# EAGLE design ACL_Rehab_Tracker (EAGLE 9.6.2)
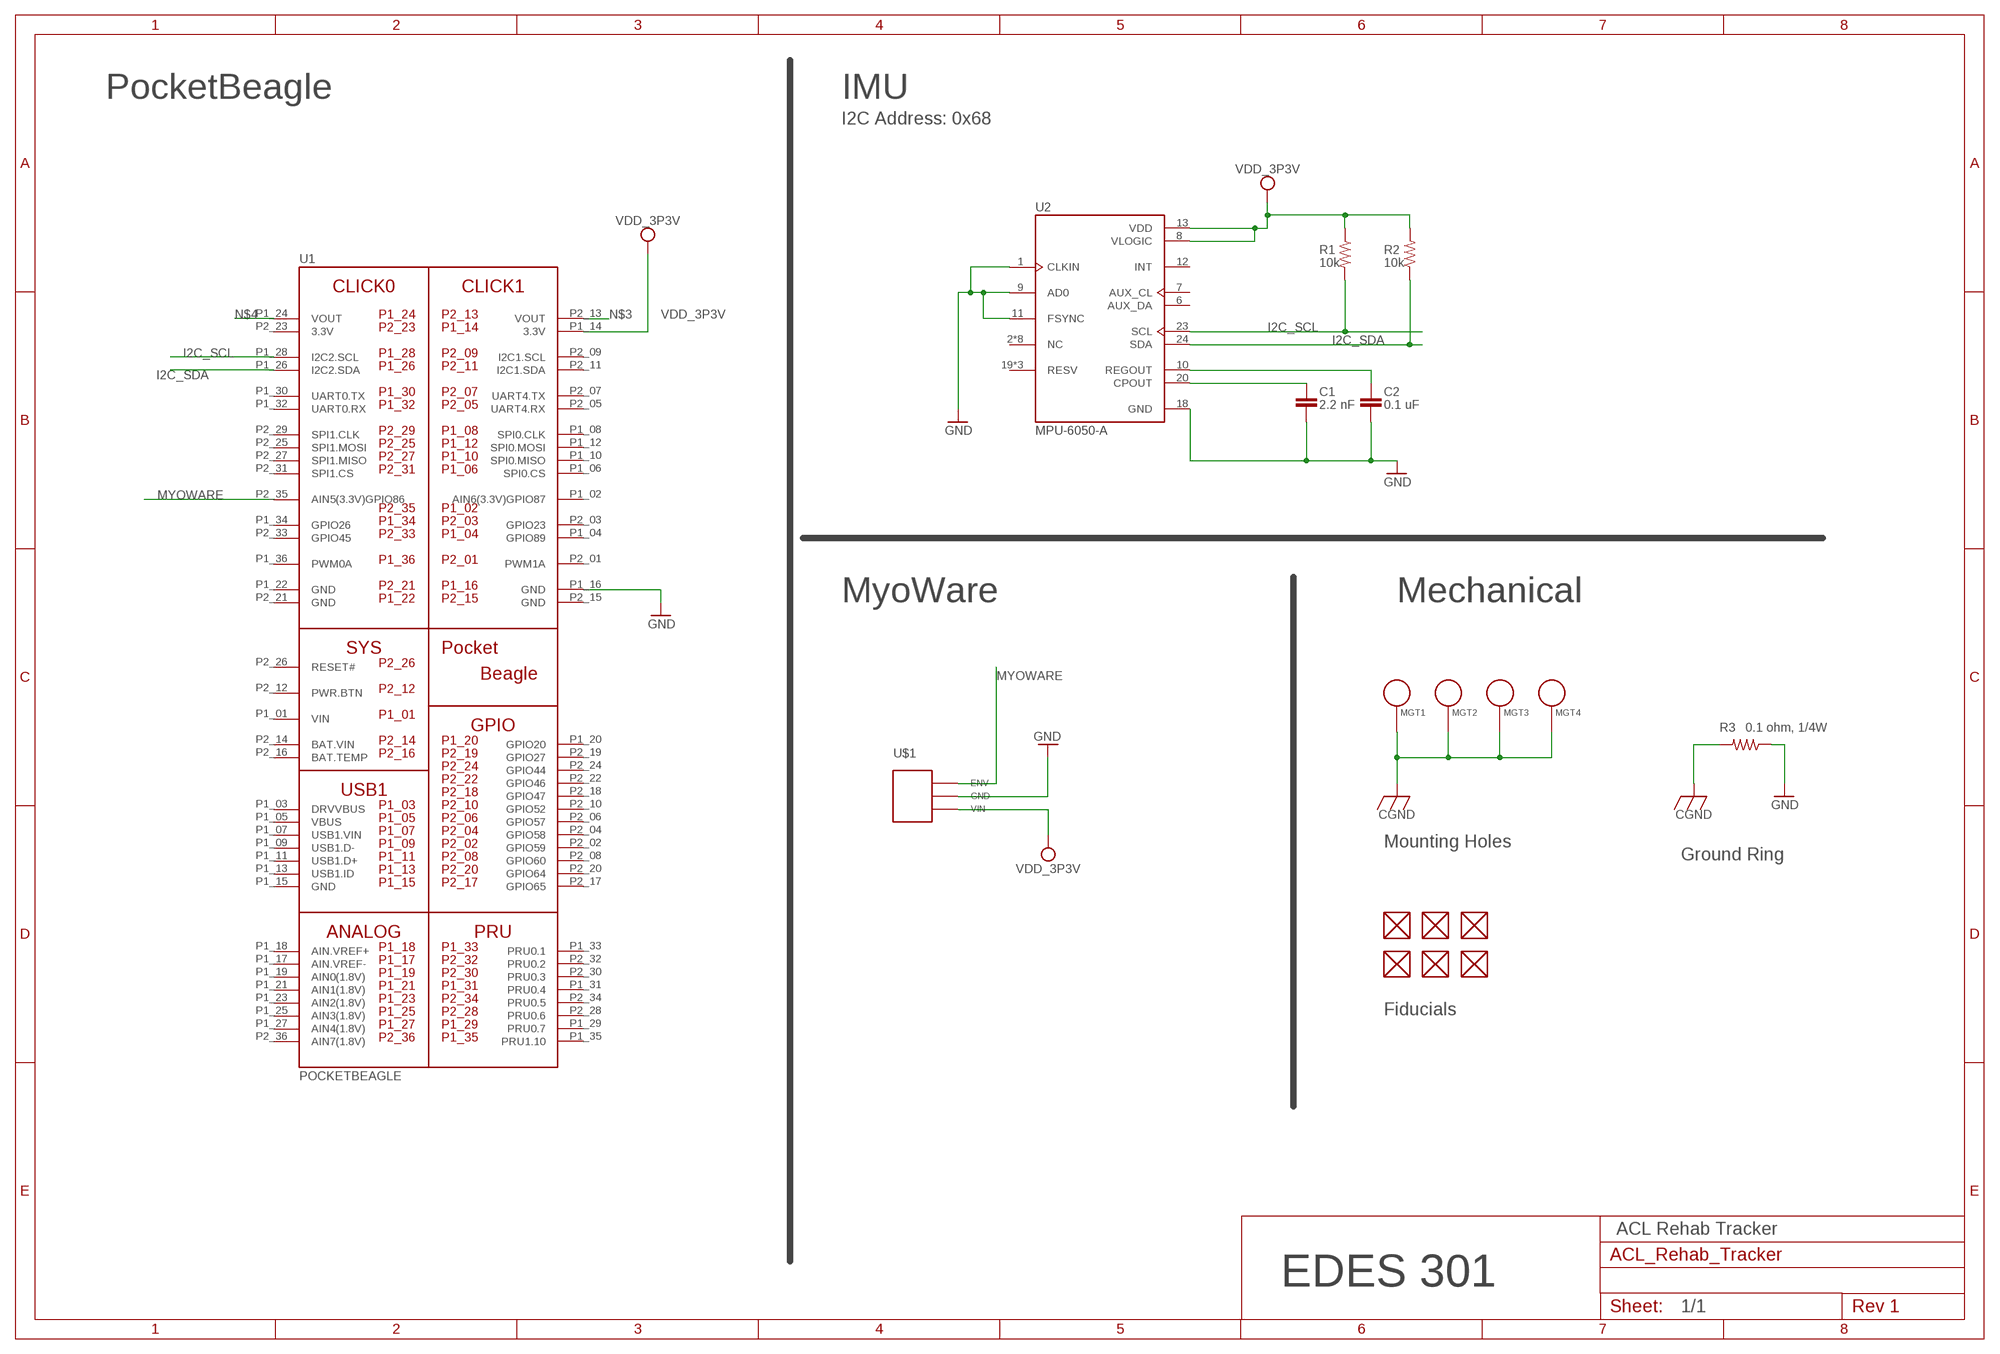
[diagram p0: schematic, sheet 1]

## Parts
C1  2.2 nF  C_C0603  [C0603]
C2  0.1 uF  C_C0603  [C0603]
FUD1  FIDUCIAL  [FIDUCIAL_40MIL]
FUD2  FIDUCIAL  [FIDUCIAL_40MIL]
FUD3  FIDUCIAL  [FIDUCIAL_40MIL]
FUD4  FIDUCIAL  [FIDUCIAL_40MIL]
FUD5  FIDUCIAL  [FIDUCIAL_40MIL]
FUD6  FIDUCIAL  [FIDUCIAL_40MIL]
MGT1  MOUNTING_HOLE  [MOUNTING_HOLE]
MGT2  MOUNTING_HOLE  [MOUNTING_HOLE]
MGT3  MOUNTING_HOLE  [MOUNTING_HOLE]
MGT4  MOUNTING_HOLE  [MOUNTING_HOLE]
R1  10k  R_R0603  [R0603]
R2  10k  R_R0603  [R0603]
R3  0.1 ohm, 1/4W  R_R0603  [R0603]
U1  POCKETBEAGLE  [POCKETBEAGLE]
U2  MPU-6050-A  [QFN50P400X400X95-24N]
U$1  MYOWARE-2.0-MUSCLE  [MYOWARE-3PIN-THR]

## Nets
CGND: MGT1.P$1 MGT2.P$1 MGT3.P$1 MGT4.P$1 R3.2
GND: C1.2 C2.2 R3.1 U1.P1_16(GND) U2.1(CLKIN) U2.9(AD0) U2.11(FSYNC) U2.18(GND) U$1.2
I2C_SCL: R1.2 U1.P1_28(I2C2.SCL) U2.23(SCL)
I2C_SDA: R2.1 U1.P1_26(I2C2.SDA) U2.24(SDA)
MYOWARE: U1.P2_35(AIN5(3.3V)GPIO86) U$1.1
N$1: C1.1 U2.20(CPOUT)
N$2: C2.1 U2.10(REGOUT)
N$3: U1.P2_13(VOUT)
N$4: U1.P1_24(VOUT)
VDD_3P3V: R1.1 R2.2 U1.P1_14(3.3V) U2.8(VLOGIC) U2.13(VDD) U$1.3
Unconnected: FUD1.P$1 FUD2.P$1 FUD3.P$1 FUD4.P$1 FUD5.P$1 FUD6.P$1 U1.P1_02(AIN6(3.3V)GPIO87) U1.P1_03(DRVVBUS) U1.P1_04(GPIO89) U1.P1_05(VBUS) U1.P1_06(SPI0.CS) U1.P1_07(USB1.VIN) U1.P1_08(SPI0.CLK) U1.P1_09(USB1.D-) U1.P1_10(SPI0.MISO) U1.P1_11(USB1.D+) U1.P1_12(SPI0.MOSI) U1.P1_13(USB1.ID) U1.P1_15(GND) U1.P1_17(AIN.VREF-) U1.P1_18(AIN.VREF+) U1.P1_19(AIN0(1.8V)) U1.P1_20(GPIO20) U1.P1_21(AIN1(1.8V)) U1.P1_23(AIN2(1.8V)) U1.P1_25(AIN3(1.8V)) U1.P1_27(AIN4(1.8V)) U1.P1_29(PRU0.7) U1.P1_30(UART0.TX) U1.P1_31(PRU0.4) U1.P1_32(UART0.RX) U1.P1_33(PRU0.1) U1.P1_34(GPIO26) U1.P1_35(PRU1.10) U1.P1_36(PWM0A) U1.P2_01(PWM1A) U1.P2_02(GPIO59) U1.P2_03(GPIO23) U1.P2_04(GPIO58) U1.P2_05(UART4.RX) U1.P2_06(GPIO57) U1.P2_07(UART4.TX) U1.P2_08(GPIO60) U1.P2_09(I2C1.SCL) U1.P2_10(GPIO52) U1.P2_11(I2C1.SDA) U1.P2_12(PWR.BTN) U1.P2_16(BAT.TEMP) U1.P2_17(GPIO65) U1.P2_18(GPIO47) U1.P2_19(GPIO27) U1.P2_20(GPIO64) U1.P2_22(GPIO46) U1.P2_24(GPIO44) U1.P2_25(SPI1.MOSI) U1.P2_26(RESET#) U1.P2_27(SPI1.MISO) U1.P2_28(PRU0.6) U1.P2_29(SPI1.CLK) U1.P2_30(PRU0.3) U1.P2_31(SPI1.CS) U1.P2_32(PRU0.2) U1.P2_33(GPIO45) U1.P2_34(PRU0.5) U1.P2_36(AIN7(1.8V)) U2.2(NC) U2.3(NC) U2.4(NC) U2.5(NC) U2.6(AUX_DA) U2.7(AUX_CL) U2.12(INT) U2.14(NC) U2.15(NC) U2.16(NC) U2.17(NC) U2.19(RESV) U2.21(RESV) U2.22(RESV)

## Notes on the sheet
- PocketBeagle | IMU
- I2C Address: 0x68
- MyoWare | Mechanical
- Mounting Holes
- Ground Ring
- Fiducials
- ACL Rehab Tracker
- EDES 301
- 1/1

## Power pins joined to a net without a drawn wire
3.3V: U1.P2_23(3.3V)
BAT.VIN: U1.P2_14(BAT.VIN)
GND: U1.P1_22(GND) U1.P2_15(GND) U1.P2_21(GND)
VIN: U1.P1_01(VIN)

## Library data of the parts
C1 C2 = Project_02_EDES_301:C_: Capacitor SMD. Sizes: 0402, 0603 & 0805
FUD1-FUD6 = Project_02_EDES_301:FIDUCIAL
MGT1-MGT4 = Project_02_EDES_301:MOUNTING_HOLE: Chassis Mounting Hole w/GND connection ability
R1-R3 = Project_02_EDES_301:R_: RESISTOR, American symbol
U1 = Project_02_EDES_301:POCKETBEAGLE
U2 = Project_02_EDES_301:MPU-6050-A: Check availability <https://pricing.snapeda.com/parts/MPU-6050-A/TDK%20InvenSense/view-part?ref=eda>; AVAILABILITY: In Stock; CHECK_PRICES: https://www.snapeda.com/parts/MPU-6050-A/TDK/view-part/?ref=eda; DESCRIPTION: MOTION TRACKING DEVICE; MF: TDK InvenSense; MP: MPU-6050-A; PACKAGE: QFN-24 InvenSense; PRICE: None; SNAPEDA_LINK: https://www.snapeda.com/parts/MPU-6050-A/TDK/view-part/?ref=snap
U$1 = Project_02_EDES_301:MYOWARE-2.0-MUSCLE

## Board
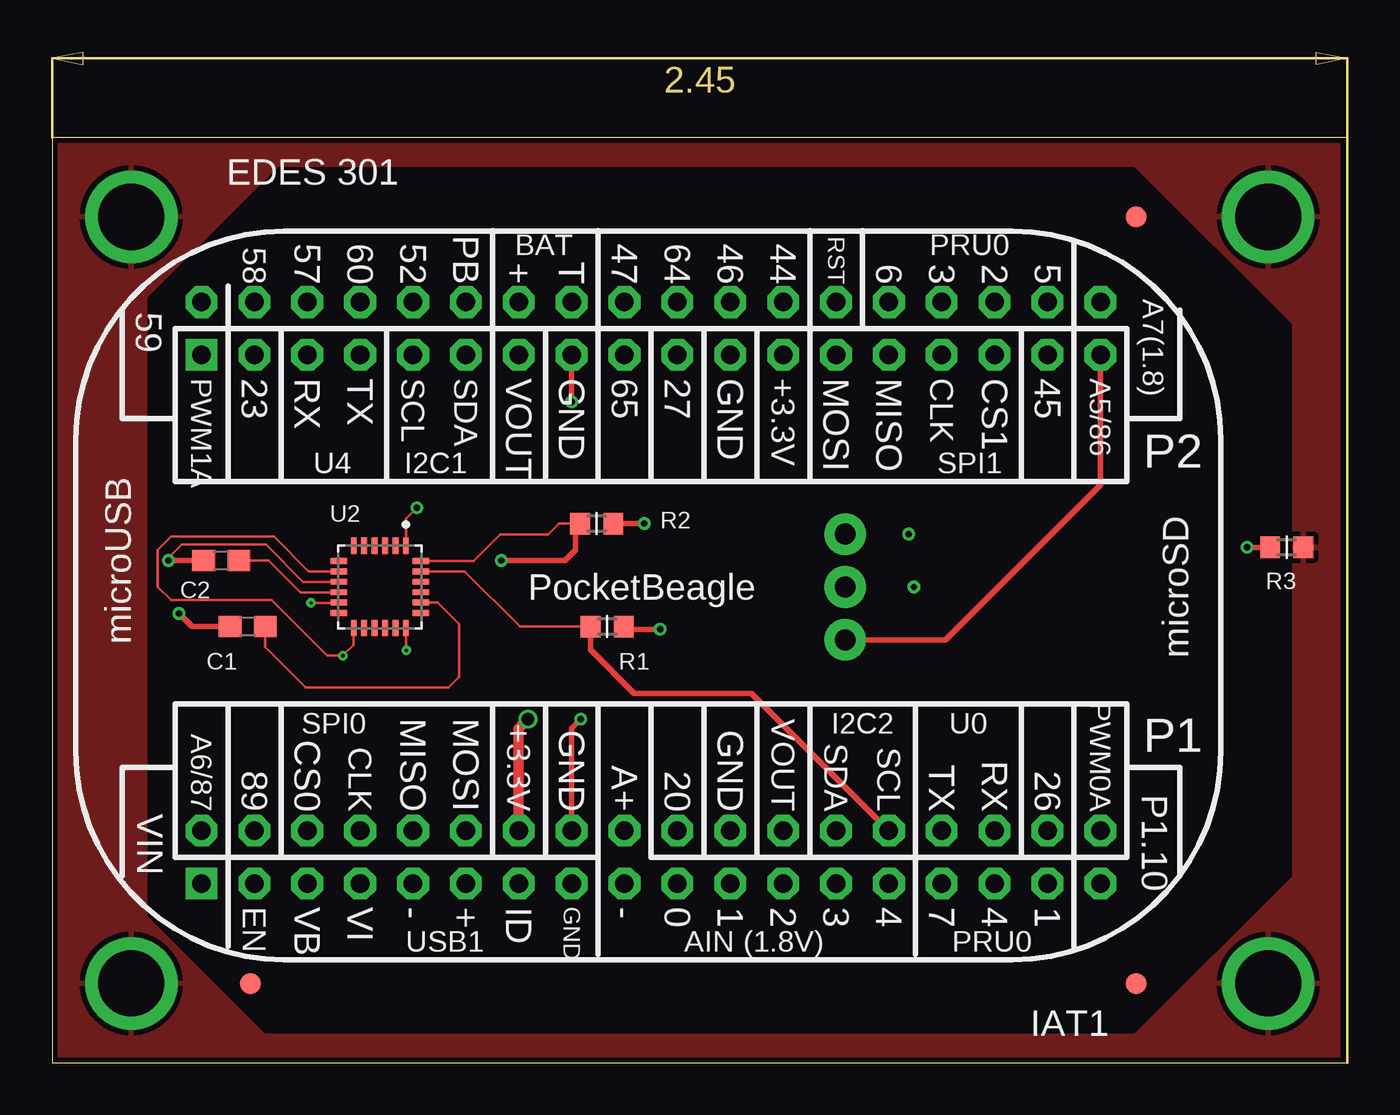
[diagram p1: board, top side]
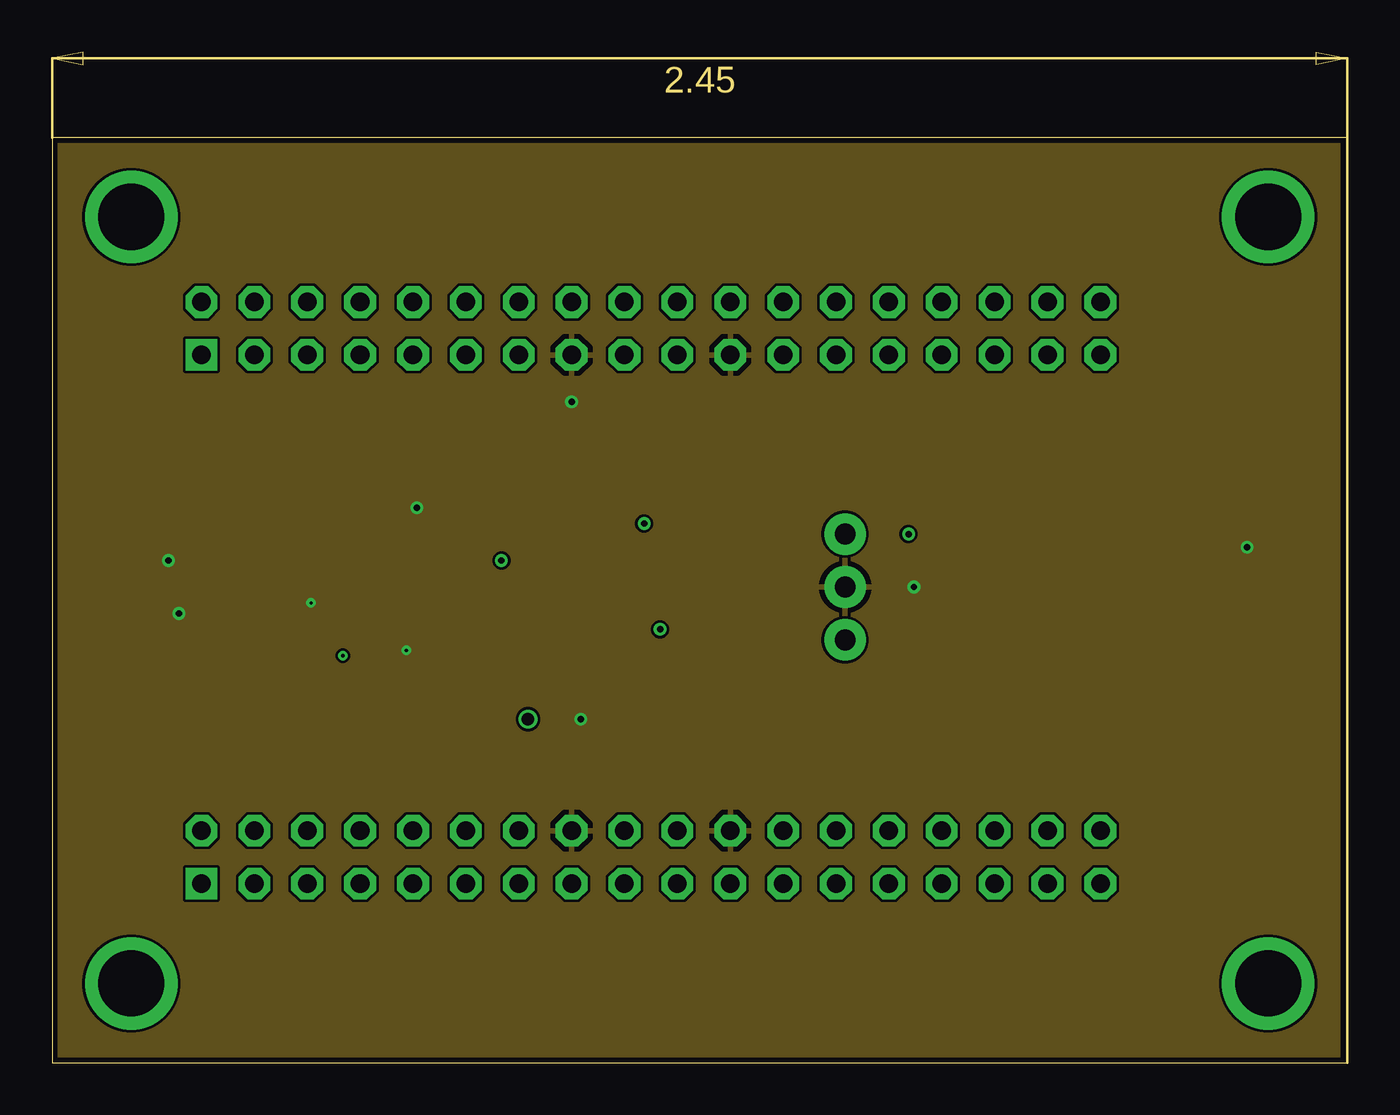
[diagram p2: board, inner layer Route2]
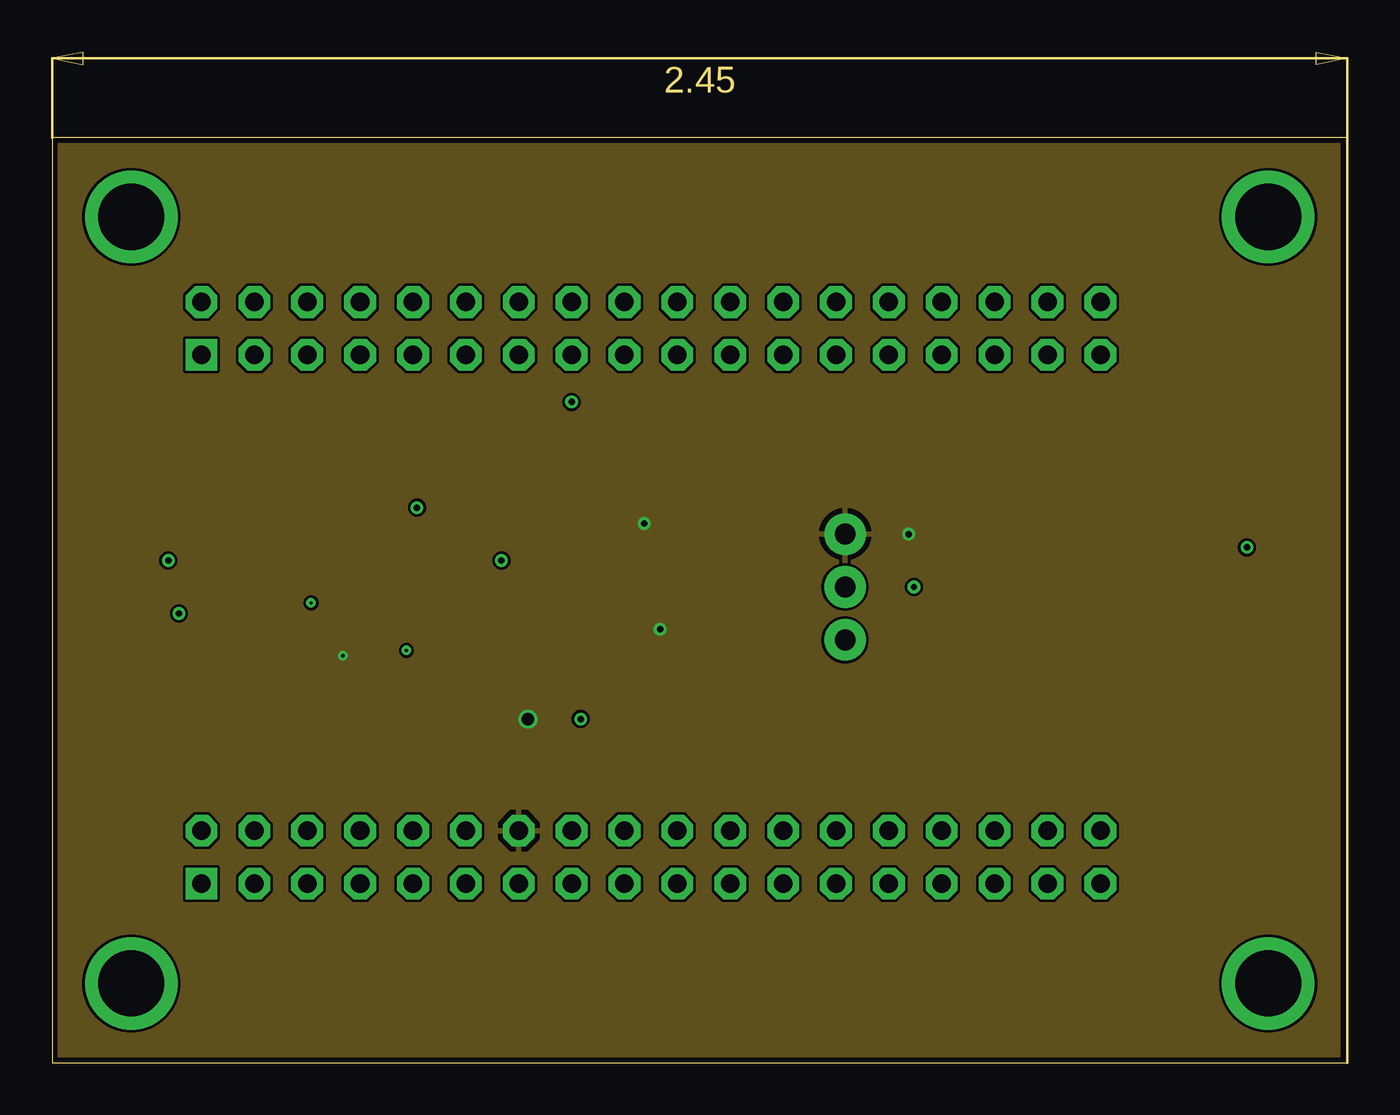
[diagram p3: board, inner layer Route15]
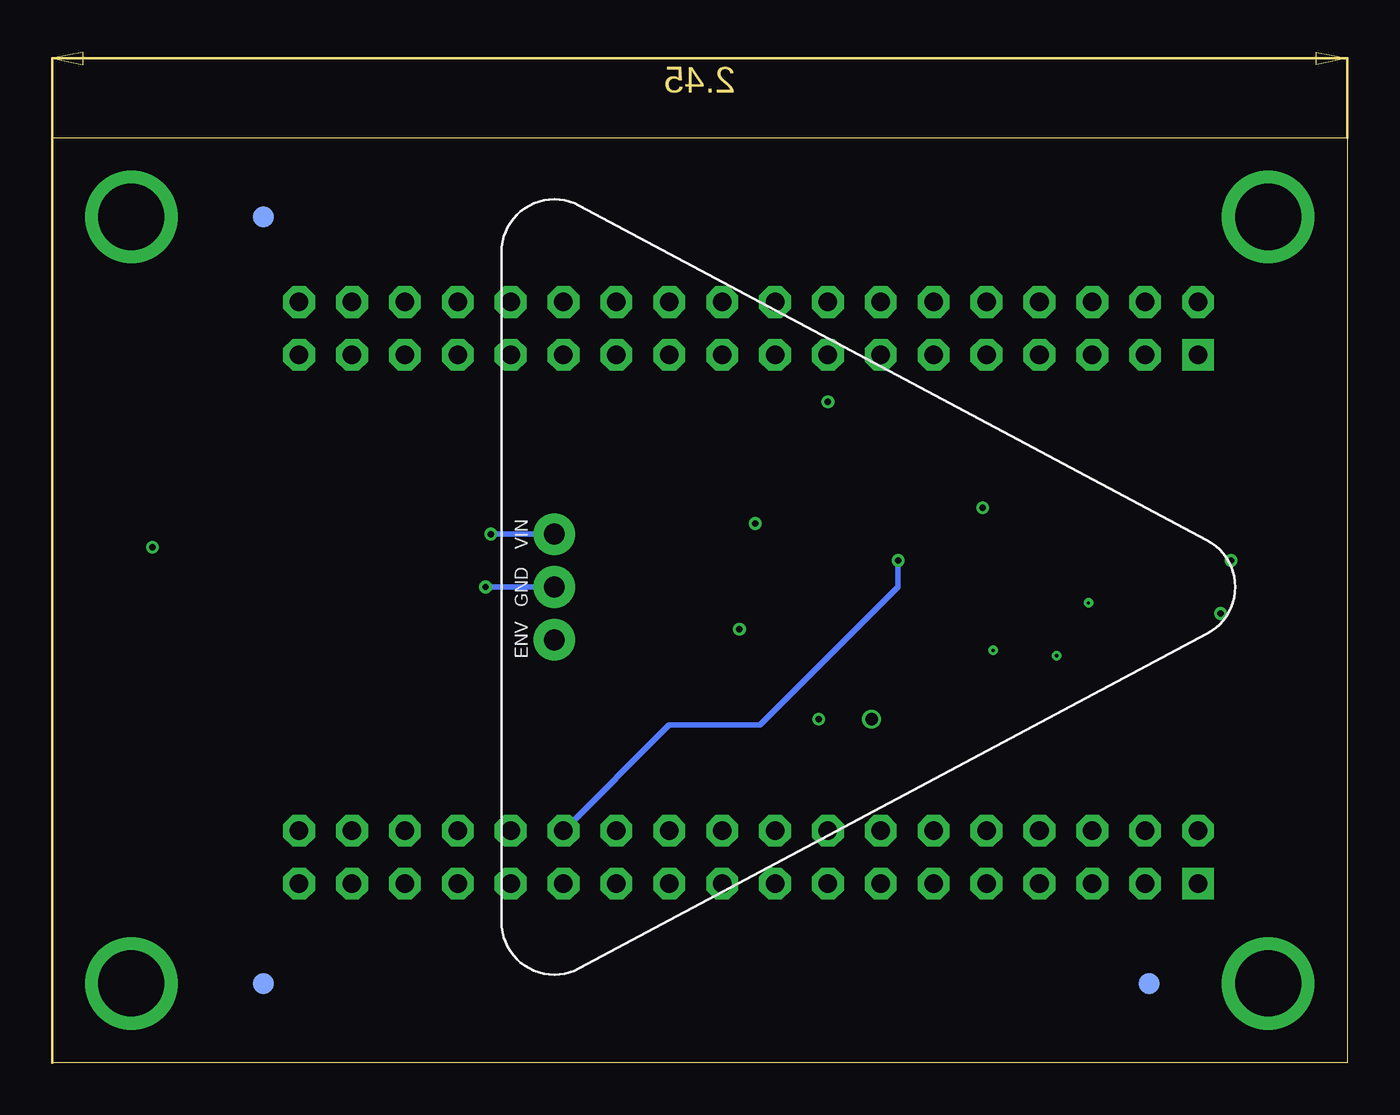
[diagram p4: board, bottom side, seen from below]

Size 62.23 x 44.45 mm. Coordinates in mm from the lower left corner, seen from the top.
Outline: 0,0 62.23,0 62.23,44.45 0,44.45 0,0
Copper layers (1*2*15*16): Top 0.035mm / dielectric 0.23mm / Route2 0.035mm / dielectric 0.93mm / Route15 0.035mm / dielectric 0.23mm / Bottom 0.035mm
Design rules "EDES301_4lyr_5-5": minimum track width 10mil, minimum drill 12mil, track to track 5mil, track to pad 5mil, pad to pad 5mil, via to via 5mil, smd to smd 5mil, copper to edge 10mil, drill to drill 12mil, minimum pad ring 6mil, minimum via ring 6mil, stop-mask expansion 3mil, vias tented up to drill 25mil, thermal gap 10mil

### Footprints (pad centres in the part's own frame; a part is rotated, then mirrored left to right if it is on the bottom)
C0603 = smd 1.1 x 1: 1 -0.85,0; 2 0.85,0
FIDUCIAL_40MIL = smd 1.016 x 1.016: P$1 0,0
MOUNTING_HOLE = drill 3.175 pad 4.445: P$1 0,0
R0603 = smd 0.95 x 1.031: 1 -0.8,0; 2 0.8,0
POCKETBEAGLE = drill 0.889 pad 1.524 square: P1_01 5.91,3.53; P2_01 5.91,28.93 | drill 0.889 pad 1.524 octagon: P1_02 5.91,6.07; P1_03 8.45,3.53; P1_04 8.45,6.07; P1_05 10.99,3.53; P1_06 10.99,6.07; P1_07 13.53,3.53; P1_08 13.53,6.07; P1_09 16.07,3.53; P1_10 16.07,6.07; P1_11 18.61,3.53; P1_12 18.61,6.07; P1_13 21.15,3.53; P1_14 21.15,6.07; P1_15 23.69,3.53; P1_16 23.69,6.07; P1_17 26.23,3.53; P1_18 26.23,6.07; P1_19 28.77,3.53; P1_20 28.77,6.07; P1_21 31.31,3.53; P1_22 31.31,6.07; P1_23 33.85,3.53; P1_24 33.85,6.07; P1_25 36.39,3.53; P1_26 36.39,6.07; P1_27 38.93,3.53; P1_28 38.93,6.07; P1_29 41.47,3.53; P1_30 41.47,6.07; P1_31 44.01,3.53; P1_32 44.01,6.07; P1_33 46.55,3.53; P1_34 46.55,6.07; P1_35 49.09,3.53; P1_36 49.09,6.07; P2_02 5.91,31.47; P2_03 8.45,28.93; P2_04 8.45,31.47; P2_05 10.99,28.93; P2_06 10.99,31.47; P2_07 13.53,28.93; P2_08 13.53,31.47; P2_09 16.07,28.93; P2_10 16.07,31.47; P2_11 18.61,28.93; P2_12 18.61,31.47; P2_13 21.15,28.93; P2_14 21.15,31.47; P2_15 23.69,28.93; P2_16 23.69,31.47; P2_17 26.23,28.93; P2_18 26.23,31.47; P2_19 28.77,28.93; P2_20 28.77,31.47; P2_21 31.31,28.93; P2_22 31.31,31.47; P2_23 33.85,28.93; P2_24 33.85,31.47; P2_25 36.39,28.93; P2_26 36.39,31.47; P2_27 38.93,28.93; P2_28 38.93,31.47; P2_29 41.47,28.93; P2_30 41.47,31.47; P2_31 44.01,28.93; P2_32 44.01,31.47; P2_33 46.55,28.93; P2_34 46.55,31.47; P2_35 49.09,28.93; P2_36 49.09,31.47
QFN50P400X400X95-24N = smd 0.79 x 0.28: 1 -1.97,1.25; 2 -1.97,0.75; 3 -1.97,0.25; 4 -1.97,-0.25; 5 -1.97,-0.75; 6 -1.97,-1.25; 13 1.97,-1.25; 14 1.97,-0.75; 15 1.97,-0.25; 16 1.97,0.25; 17 1.97,0.75; 18 1.97,1.25 | smd 0.28 x 0.79: 7 -1.25,-1.97; 8 -0.75,-1.97; 9 -0.25,-1.97; 10 0.25,-1.97; 11 0.75,-1.97; 12 1.25,-1.97; 19 1.25,1.97; 20 0.75,1.97; 21 0.25,1.97; 22 -0.25,1.97; 23 -0.75,1.97; 24 -1.25,1.97
MYOWARE-3PIN-THR = drill 1 pad 2: 1 -2.54,0; 2 0,0; 3 2.54,0

### Placement (x,y rotation side)
C1  9.4,20.95 180 top
C2  8.13,24.13 180 top
FUD1  9.53,3.81 0 top
FUD2  52.07,3.81 0 top
FUD3  52.07,40.64 0 top
FUD4  52.07,40.64 0 bottom
FUD5  52.07,3.81 0 bottom
FUD6  9.53,3.81 0 bottom
MGT1  3.81,40.64 0 top
MGT2  3.81,3.81 0 top
MGT3  58.42,3.81 0 top
MGT4  58.42,40.64 0 top
R1  26.67,20.95 180 top
R2  26.16,25.91 0 top
R3  59.31,24.77 0 top
U1  1.27,5.08 0 top
U2  15.75,22.86 270 top
U$1  38.1,22.86 90 bottom

### Tracks (layer width: path | path; a pad name or v marks a point on that pad's centre or on a via)
CGND
  pour Top: -3.17,23.5 4.45,23.5 4.45,6.99 10.16,1.27 52.07,1.27 59.69,8.89 59.69,22.86 64.77,22.86 64.77,0.64 60.96,-3.17 0.64,-3.17 -3.17,0.64
  pour Top: 59.69,22.86 59.69,35.56 52.07,43.18 10.79,43.18 4.45,36.83 4.45,23.5 -3.17,23.5 -3.17,42.55 1.91,47.62 62.23,47.62 64.77,45.09 64.77,22.86
GND  (via drill 0.15 pad 0.3, 0.3 pad 0.3, 0.3 pad 0.61)
  Top 0.127: 13.77,22.1 v12.45,22.1 | U2.1 17,26.14 v17.53,26.67 | U2.9 12.07,23.11 10.29,24.89 6.22,24.89 5.59,24.26 | 17.02,20.87 v17.02,19.81
  Top 0.254: R3.1 v57.4,24.77 | U1.P2_15 v24.96,31.75 | C2.2 v5.59,24.13 5.59,24.26 | C1.2 6.73,20.95 v6.1,21.59 | U2.11 13.77,22.1 | U1.P1_16 24.96,16.07 v25.4,16.51 | U2.18 17.02,20.87
  Bottom 0.254: U$1.2 v41.4,22.86
  pour Route2: -10.16,-5.08 -10.16,48.26 71.12,48.26 71.12,-10.16 -10.16,-10.16
I2C_SCL
  Top 0.127: U2.23 19.82,23.61 22.48,20.95 R1.2
  Top 0.254: U1.P1_28 33.6,17.75 27.97,17.75 25.87,19.85 R1.2
I2C_SDA  (via drill 0.3 pad 0.61)
  Top 0.127: R2.1 25.15,25.91 24.35,25.91 23.82,25.38 21.53,25.38 20.26,24.11 U2.24
  Top 0.254: v21.59,24.13 24.64,24.13 25.15,24.64 25.15,25.91
  Bottom 0.254: U1.P1_26 32.58,16.23 28.22,16.23 21.59,22.86 v21.59,24.13
MYOWARE
  Top 0.254: U$1.1 42.93,20.32 50.36,27.75 U1.P2_35
N$1
  Top 0.127: U2.20 18.53,22.11 19.56,21.08 19.56,18.54 19.05,18.03 12.19,18.03 10.25,19.98 C1.1
N$2
  Top 0.127: C2.1 10.41,24.13 11.94,22.61 U2.10
  Top 0.254: U2.10
VDD_3P3V  (via drill 0.15 pad 0.3, 0.3 pad 0.61, 0.6 pad 0.8)
  Top 0.127: U2.13 14.5,20.09 v13.97,19.56 13.21,19.56 10.54,22.23 5.71,22.23 5.08,22.86 5.08,24.64 5.71,25.27 10.67,25.27 12.33,23.61 U2.8
  Top 0.254: R1.1 27.6,20.83 v29.21,20.83 | R2.2 v28.45,25.91
  Top 0.508: U1.P1_14 22.42,16.07 v22.86,16.51
  Bottom 0.254: U$1.3 v41.15,25.4
  pour Route15: -12.7,-12.7 -12.7,50.8 73.66,50.8 73.66,-12.7

### Text on the board
tPlace: EDES 301 | IAT1